# EAGLE design mplex_v2 (EAGLE 7.2.0)

## Sheet 1 of 3
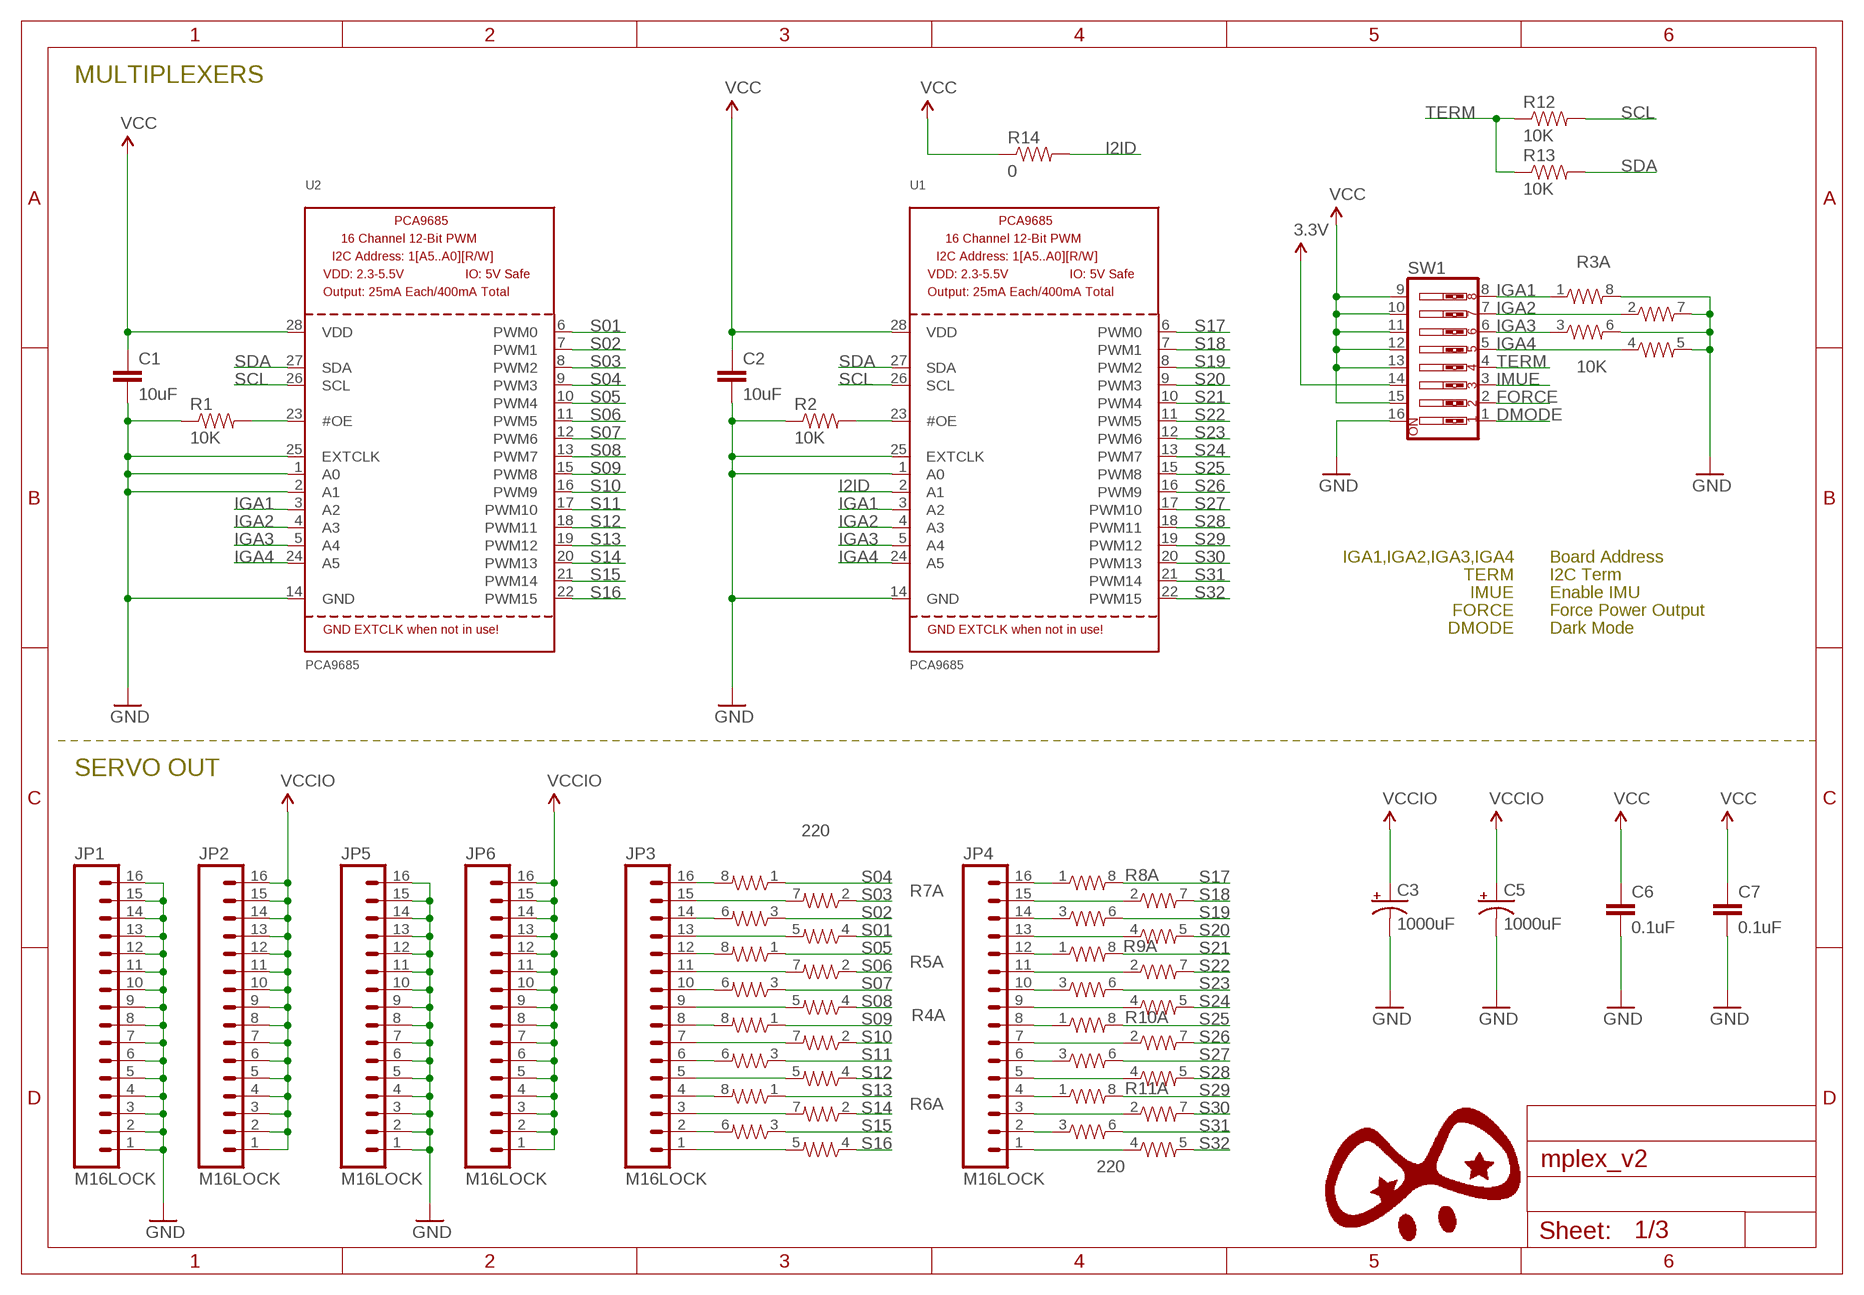
[diagram p0: schematic, sheet 1]

### Parts
C1  10uF  10UF-6.3V-20%(0603)  [0603-CAP]
C2  10uF  10UF-6.3V-20%(0603)  [0603-CAP]
C3  1000uF  CAP_POLD  [PANASONIC_D]
C5  1000uF  CAP_POLD  [PANASONIC_D]
C6  0.1uF  10UF-6.3V-20%(0603)  [0603-CAP]
C7  0.1uF  10UF-6.3V-20%(0603)  [0603-CAP]
JP1  M16LOCK  [1X16_LOCK]
JP2  M16LOCK  [1X16_LOCK]
JP3  M16LOCK  [1X16_LOCK]
JP4  M16LOCK  [1X16_LOCK]
JP5  M16LOCK  [1X16_LOCK]
JP6  M16LOCK  [1X16_LOCK]
R1  10K  RESISTOR0603  [0603-RES]
R2  10K  RESISTOR0603  [0603-RES]
R3  10K  RESISTOR-ARRAY0603-ARV  [0603-ARV]
R4  220  RESISTOR-ARRAY0603-ARV  [0603-ARV]
R5  220  RESISTOR-ARRAY0603-ARV  [0603-ARV]
R6  220  RESISTOR-ARRAY0603-ARV  [0603-ARV]
R7  220  RESISTOR-ARRAY0603-ARV  [0603-ARV]
R8  220  RESISTOR-ARRAY0603-ARV  [0603-ARV]
R9  220  RESISTOR-ARRAY0603-ARV  [0603-ARV]
R10  220  RESISTOR-ARRAY0603-ARV  [0603-ARV]
R11  220  RESISTOR-ARRAY0603-ARV  [0603-ARV]
R12  10K  RESISTOR0603  [0603-RES]
R13  10K  RESISTOR0603  [0603-RES]
R14  0  RESISTOR0603  [0603-RES]
SW1  SW_DIP-8-SMT-HALFSIZE  [DIPSWITCH-08-50MIL]
U1  PCA9685  [TSSOP28]
U2  PCA9685  [TSSOP28]

### Nets
3.3V: SW1.14 ; also sheet 2,3
DMODE: SW1.1 ; also sheet 2
FORCE: SW1.2 ; also sheet 2,3
GND [PlanGND]: C1.2 C2.2 C3.- C5.- C6.2 C7.2 JP1.1 JP1.2 JP1.3 JP1.4 JP1.5 JP1.6 JP1.7 JP1.8 JP1.9 JP1.10 JP1.11 JP1.12 JP1.13 JP1.14 JP1.15 JP1.16 JP5.1 JP5.2 JP5.3 JP5.4 JP5.5 JP5.6 JP5.7 JP5.8 JP5.9 JP5.10 JP5.11 JP5.12 JP5.13 JP5.14 JP5.15 JP5.16 R1.1 R2.1 R3.5 R3.6 R3.7 R3.8 SW1.16 U1.1(A0) U1.14(GND) U1.25(EXTCLK) U2.1(A0) U2.2(A1) U2.14(GND) U2.25(EXTCLK) ; also sheet 2,3
I2ID: R14.2 U1.2(A1)
IGA1: R3.1 SW1.8 U1.3(A2) U2.3(A2) ; also sheet 3
IGA2: R3.2 SW1.7 U1.4(A3) U2.4(A3) ; also sheet 3
IGA3: R3.3 SW1.6 U1.5(A4) U2.5(A4) ; also sheet 3
IGA4: R3.4 SW1.5 U1.24(A5) U2.24(A5) ; also sheet 3
IMUE: SW1.3 ; also sheet 2
N$1: JP3.16 R7.8
N$2: JP3.15 R7.7
N$3: R1.2 U2.23(#OE)
N$4: R2.2 U1.23(#OE)
N$5: JP3.14 R7.6
N$6: JP3.13 R7.5
N$7: JP3.11 R5.7
N$8: JP3.12 R5.8
N$9: JP3.10 R5.6
N$10: JP3.9 R5.5
N$11: JP3.8 R4.8
N$12: JP3.7 R4.7
N$13: JP3.6 R4.6
N$14: JP3.5 R4.5
N$15: JP3.4 R6.8
N$16: JP3.3 R6.7
N$17: JP3.2 R6.6
N$18: JP3.1 R6.5
N$35: JP4.16 R8.1
N$36: JP4.15 R8.2
N$37: JP4.14 R8.3
N$38: JP4.13 R8.4
N$39: JP4.12 R9.1
N$40: JP4.11 R9.2
N$41: JP4.10 R9.3
N$42: JP4.9 R9.4
N$43: JP4.8 R10.1
N$44: JP4.7 R10.2
N$45: JP4.6 R10.3
N$46: JP4.5 R10.4
N$47: JP4.4 R11.1
N$48: JP4.3 R11.2
N$49: JP4.2 R11.3
N$50: JP4.1 R11.4
S01: R7.4 U2.6(PWM0)
S02: R7.3 U2.7(PWM1)
S03: R7.2 U2.8(PWM2)
S04: R7.1 U2.9(PWM3)
S05: R5.1 U2.10(PWM4)
S06: R5.2 U2.11(PWM5)
S07: R5.3 U2.12(PWM6)
S08: R5.4 U2.13(PWM7)
S09: R4.1 U2.15(PWM8)
S10: R4.2 U2.16(PWM9)
S11: R4.3 U2.17(PWM10)
S12: R4.4 U2.18(PWM11)
S13: R6.1 U2.19(PWM12)
S14: R6.2 U2.20(PWM13)
S15: R6.3 U2.21(PWM14)
S16: R6.4 U2.22(PWM15)
S17: R8.8 U1.6(PWM0)
S18: R8.7 U1.7(PWM1)
S19: R8.6 U1.8(PWM2)
S20: R8.5 U1.9(PWM3)
S21: R9.8 U1.10(PWM4)
S22: R9.7 U1.11(PWM5)
S23: R9.6 U1.12(PWM6)
S24: R9.5 U1.13(PWM7)
S25: R10.8 U1.15(PWM8)
S26: R10.7 U1.16(PWM9)
S27: R10.6 U1.17(PWM10)
S28: R10.5 U1.18(PWM11)
S29: R11.8 U1.19(PWM12)
S30: R11.7 U1.20(PWM13)
S31: R11.6 U1.21(PWM14)
S32: R11.5 U1.22(PWM15)
SCL: R12.2 U1.26(SCL) U2.26(SCL) ; also sheet 2,3
SDA: R13.2 U1.27(SDA) U2.27(SDA) ; also sheet 2,3
TERM: R12.1 R13.1 SW1.4
VCC: C1.1 C2.1 C6.1 C7.1 R14.1 SW1.9 SW1.10 SW1.11 SW1.12 SW1.13 SW1.15 U1.28(VDD) U2.28(VDD) ; also sheet 2,3
VCCIO: C3.+ C5.+ JP2.1 JP2.2 JP2.3 JP2.4 JP2.5 JP2.6 JP2.7 JP2.8 JP2.9 JP2.10 JP2.11 JP2.12 JP2.13 JP2.14 JP2.15 JP2.16 JP6.1 JP6.2 JP6.3 JP6.4 JP6.5 JP6.6 JP6.7 JP6.8 JP6.9 JP6.10 JP6.11 JP6.12 JP6.13 JP6.14 JP6.15 JP6.16 ; also sheet 2,3

### Notes on the sheet
- MULTIPLEXERS
- IGA1,IGA2,IGA3,IGA4 | Board Address
- TERM | I2C Term
- IMUE | Enable IMU
- FORCE | Force Power Output
- DMODE | Dark Mode
- SERVO OUT

## Sheet 2 of 3
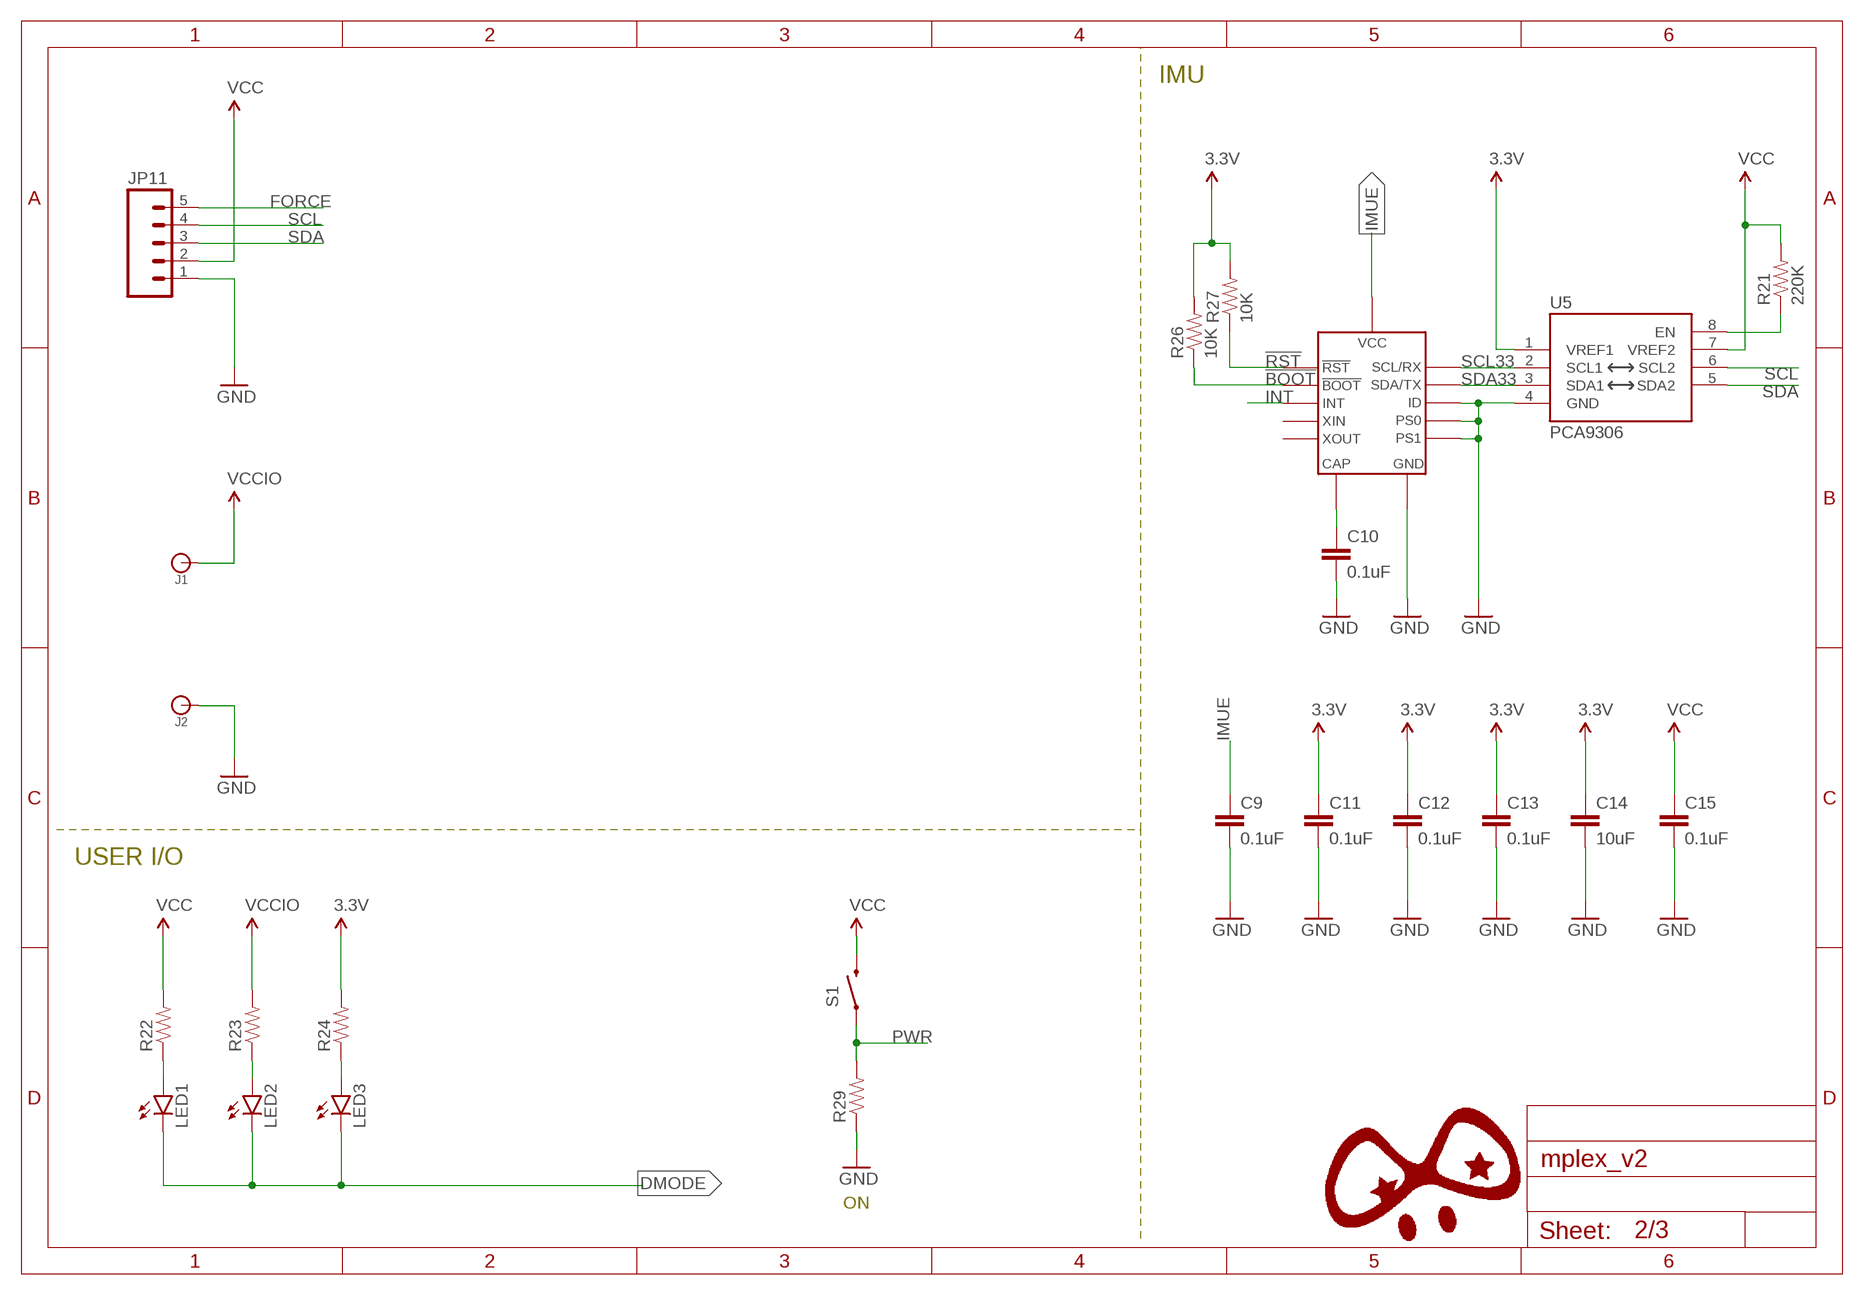
[diagram p1: schematic, sheet 2]

### Parts
C9  0.1uF  10UF-6.3V-20%(0603)  [0603-CAP]
C10  0.1uF  10UF-6.3V-20%(0603)  [0603-CAP]
C11  0.1uF  10UF-6.3V-20%(0603)  [0603-CAP]
C12  0.1uF  10UF-6.3V-20%(0603)  [0603-CAP]
C13  0.1uF  10UF-6.3V-20%(0603)  [0603-CAP]
C14  10uF  10UF-6.3V-20%(0603)  [0603-CAP]
C15  0.1uF  10UF-6.3V-20%(0603)  [0603-CAP]
J1  BANANA_CONN  [BANANA_CONN]
J2  BANANA_CONN  [BANANA_CONN]
JP11  M05LOCK  [1X05_LOCK]
LED1  LED0603  [LED-0603]
LED2  LED0603  [LED-0603]
LED3  LED0603  [LED-0603]
R21  220K  RESISTOR0603-RES  [0603-RES]
R22  RESISTOR0603-RES  [0603-RES]
R23  RESISTOR0603-RES  [0603-RES]
R24  RESISTOR0603-RES  [0603-RES]
R26  10K  RESISTOR0603  [0603-RES]
R27  10K  RESISTOR0603  [0603-RES]
R29  RESISTOR0603-RES  [0603-RES]
S1  SWITCH-MOMENTARY-2SMD  [TACTILE-SWITCH-SMD]
U4  BNO055  [BNO055]
U5  PCA9306  PCA9306PCA9306DC-1:1  [PCA9306DC-1:1]

### Nets
3.3V: C11.1 C12.1 C13.1 C14.1 R24.2 R26.2 R27.2 U5.1(VREF1) ; also sheet 1,3
!BOOT: R26.1 U4.4(BOOT)
!RST: R27.1 U4.1(RST)
DMODE: LED1.C LED2.C LED3.C ; also sheet 1
FORCE: JP11.5 ; also sheet 1,3
GND [PlanGND]: C9.2 C10.2 C11.2 C12.2 C13.2 C14.2 C15.2 J2.P$1 JP11.1 R29.1 U4.2(GND) U4.5(PS1) U4.6(PS0) U4.10(GND) U4.15(GND) U4.16(GND) U4.17(ID) U4.18(GND) U4.25(GND) U5.4(GND) ; also sheet 1,3
IMUE: C9.1 U4.3(VCC) U4.28(VCC) ; also sheet 1
INT: U4.14(INT)
N$19: LED1.A R22.1
N$20: R21.1 U5.8(EN)
N$22: LED2.A R23.1
N$24: C10.1 U4.9(CAP)
N$25: LED3.A R24.1
PWR: R29.2 S1.1
SCL: JP11.4 U5.6(SCL2) ; also sheet 1,3
SCL33: U4.19(SCL/RX) U5.2(SCL1)
SDA: JP11.3 U5.5(SDA2) ; also sheet 1,3
SDA33: U4.20(SDA/TX) U5.3(SDA1)
VCC: C15.1 JP11.2 R21.2 R22.2 S1.3 U5.7(VREF2) ; also sheet 1,3
VCCIO: J1.P$1 R23.2 ; also sheet 1,3
Unconnected: U4.26(XOUT) U4.27(XIN)

### Notes on the sheet
- IMU
- USER I/O
- ON

## Sheet 3 of 3
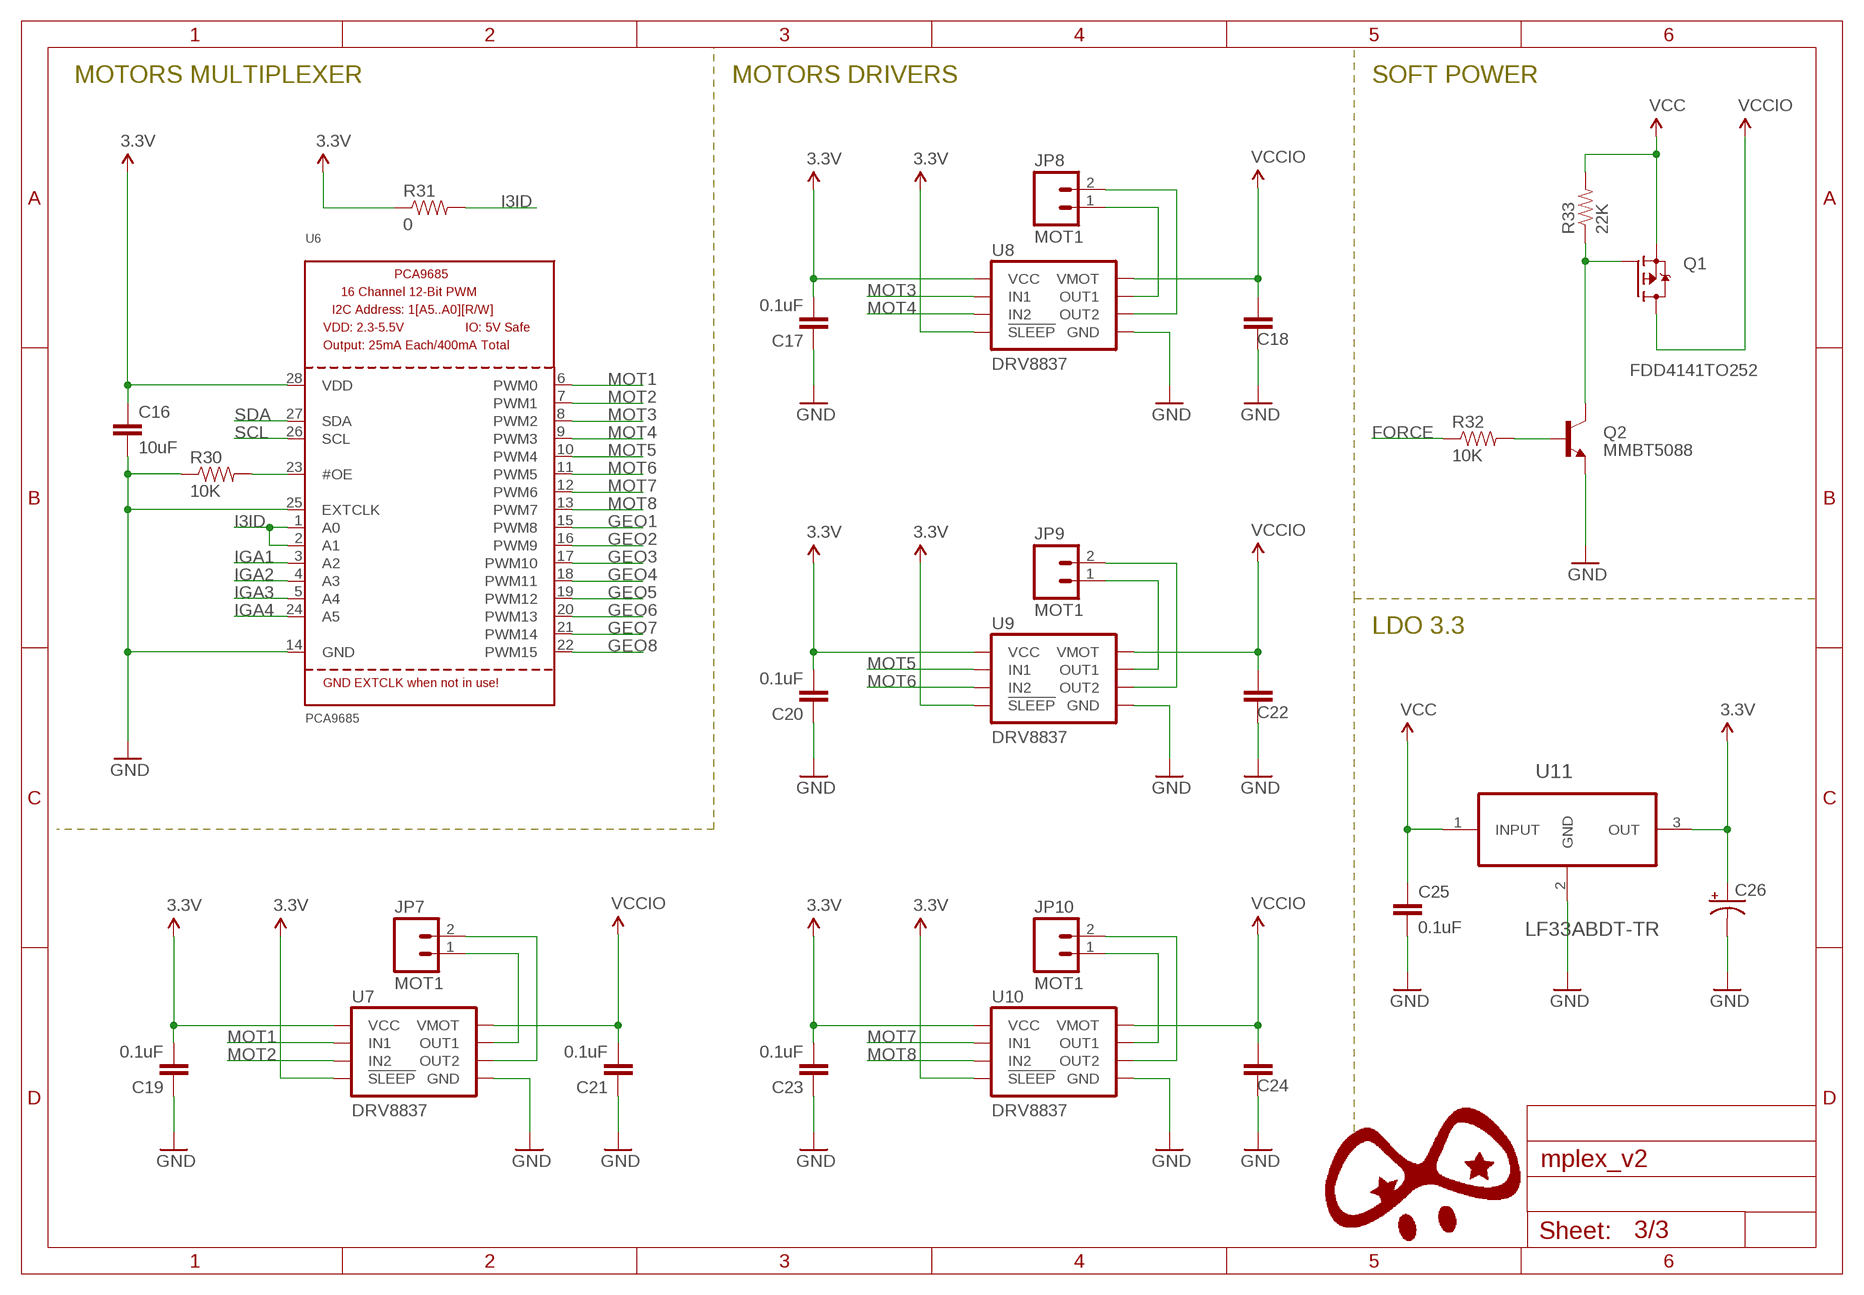
[diagram p2: schematic, sheet 3]

### Parts
C16  10uF  10UF-6.3V-20%(0603)  [0603-CAP]
C17  0.1uF  CAP0603-CAP  [0603-CAP]
C18  0.1uF  CAP0603-CAP  [0603-CAP]
C19  0.1uF  CAP0603-CAP  [0603-CAP]
C20  0.1uF  CAP0603-CAP  [0603-CAP]
C21  0.1uF  CAP0603-CAP  [0603-CAP]
C22  0.1uF  CAP0603-CAP  [0603-CAP]
C23  0.1uF  CAP0603-CAP  [0603-CAP]
C24  0.1uF  CAP0603-CAP  [0603-CAP]
C25  0.1uF  CAP1210  [1210]
C26  CAP_POLD  [PANASONIC_D]
JP7  MOT1  M02POLAR  [MOLEX-1X2]
JP8  MOT1  M02POLAR  [MOLEX-1X2]
JP9  MOT1  M02POLAR  [MOLEX-1X2]
JP10  MOT1  M02POLAR  [MOLEX-1X2]
Q1  FDD4141TO252  [TO252]
Q2  MMBT5088  TRANSISTOR_NPNMMBT5088  [SOT23-3]
R30  10K  RESISTOR0603  [0603-RES]
R31  0  RESISTOR0603  [0603-RES]
R32  10K  RESISTOR0603  [0603-RES]
R33  22K  RESISTOR0603  [0603-RES]
U6  PCA9685  [TSSOP28]
U7  DRV8837  [DSG]
U8  DRV8837  [DSG]
U9  DRV8837  [DSG]
U10  DRV8837  [DSG]
U11  LF33ABDT-TR  [TO228P972X240-3N]

### Nets
3.3V: C16.1 C17.2 C19.2 C20.2 C23.2 C26.+ R31.1 U6.28(VDD) U7.7(!SLEEP) U7.8(VCC) U8.7(!SLEEP) U8.8(VCC) U9.7(!SLEEP) U9.8(VCC) U10.7(!SLEEP) U10.8(VCC) U11.3(OUT) ; also sheet 1,2
FORCE: R32.1 ; also sheet 1,2
GEO1: U6.15(PWM8)
GEO2: U6.16(PWM9)
GEO3: U6.17(PWM10)
GEO4: U6.18(PWM11)
GEO5: U6.19(PWM12)
GEO6: U6.20(PWM13)
GEO7: U6.21(PWM14)
GEO8: U6.22(PWM15)
GND [PlanGND]: C16.2 C17.1 C18.1 C19.1 C20.1 C21.1 C22.1 C23.1 C24.1 C25.2 C26.- Q2.2(E) R30.1 U6.14(GND) U6.25(EXTCLK) U7.4(GND) U7.PAD(GND) U8.4(GND) U8.PAD(GND) U9.4(GND) U9.PAD(GND) U10.4(GND) U10.PAD(GND) U11.2(GND) ; also sheet 1,2
I3ID: R31.2 U6.1(A0) U6.2(A1)
IGA1: U6.3(A2) ; also sheet 1
IGA2: U6.4(A3) ; also sheet 1
IGA3: U6.5(A4) ; also sheet 1
IGA4: U6.24(A5) ; also sheet 1
MOT1: U6.6(PWM0) U7.6(IN1)
MOT2: U6.7(PWM1) U7.5(IN2)
MOT3: U6.8(PWM2) U8.6(IN1)
MOT4: U6.9(PWM3) U8.5(IN2)
MOT5: U6.10(PWM4) U9.6(IN1)
MOT6: U6.11(PWM5) U9.5(IN2)
MOT7: U6.12(PWM6) U10.6(IN1)
MOT8: U6.13(PWM7) U10.5(IN2)
N$23: R30.2 U6.23(#OE)
N$26: JP7.1 U7.2(OUT1)
N$28: JP7.2 U7.3(OUT2)
N$29: JP8.1 U8.2(OUT1)
N$30: JP8.2 U8.3(OUT2)
N$31: JP9.1 U9.2(OUT1)
N$32: JP9.2 U9.3(OUT2)
N$33: JP10.1 U10.2(OUT1)
N$34: Q2.1(B) R32.2
N$52: Q1.1(G) Q2.3(C) R33.1
N$66: JP10.2 U10.3(OUT2)
SCL: U6.26(SCL) ; also sheet 1,2
SDA: U6.27(SDA) ; also sheet 1,2
VCC: C25.1 Q1.2(S) R33.2 U11.1(INPUT) ; also sheet 1,2
VCCIO: C18.2 C21.2 C22.2 C24.2 Q1.3(D) U7.1(VMOT) U8.1(VMOT) U9.1(VMOT) U10.1(VMOT) ; also sheet 1,2

### Notes on the sheet
- MOTORS MULTIPLEXER | MOTORS DRIVERS | SOFT POWER
- LDO 3.3

## Library data of the parts
C1 C2 C14 C16 = SparkFun-Capacitors:10UF-6.3V-20%(0603): CAP-11015; PROD_ID: CAP-11015
C3 C5 C26 = SparkFun-Capacitors:CAP_POL: Capacitor Polarized These are standard SMD and PTH capacitors. Normally 10uF, 47uF, and 100uF in electrolytic and tantalum varieties. Always verify the external diameter of the through hole cap, it varies with capacity, voltage, and manufacturer. The EIA devices should be standard.
C6 C7 C9-C13 C15 = SparkFun-Capacitors:10UF-6.3V-20%(0603): CAP-11015; PROD_ID: CAP-11015; VALUE: 10uF
C17-C24 = SparkFun-Passives:CAP: Capacitor Standard 0603 ceramic capacitor, and 0.1" leaded capacitor.
C25 = SparkFun-Capacitors:CAP: Capacitor Standard 0603 ceramic capacitor, and 0.1" leaded capacitor.
J1 J2 = SparkFun-Connectors:BANANA_CONN: Through-hole banana jack
JP1-JP6 = SparkFun-Connectors:M16: 1x16 .1" header
JP7-JP10 = SparkFun-Connectors:M02: Standard 2-pin 0.1" header. Use with - straight break away headers ( PRT-00116) - right angle break away headers (PRT-00553) - swiss pins (PRT-00743) - machine pins (PRT-00117) - female headers (PRT-00115) Molex polarized connector foot print use with: PRT-08233 with associated crimp pins and housings. 2.54_SCREWTERM for use with PRT-10571. 3.5mm Screw Terminal footprints for PRT-08084 5mm Screw Terminal footprints for use with PRT-08432
JP11 = SparkFun-Connectors:M05: Header 5 Standard 5-pin 0.1" header. Use with straight break away headers (SKU : PRT-00116), right angle break away headers (PRT-00553), swiss pins (PRT-00743), machine pins (PRT-00117), and female headers (PRT-00115). Molex polarized connector foot print use with SKU : PRT-08230 with associated crimp pins and housings.
LED1-LED3 = SparkFun-LED:LED: LEDs Standard schematic elements and footprints for 5mm, 3mm, 1206, and 0603 sized LEDs. 5mm - Spark Fun Electronics SKU : COM-00529 (and others)
Q1 = transistor-fet:FDD4141: P-Channel PowerTrench® MOSFET Source: FDD4141.pdf
Q2 = SparkFun-DiscreteSemi:TRANSISTOR_NPN: Generic NPN BJT MMBT2222A - TRANS-08049 (SOT-23, 1A 40V) MPSA42 - TRANS-09116 (SOT-23, 500mA 300V) MMBT5088LT1G - TRANS-11160 (SOT-23, 50 mA 30V) BC547 - COM-08928 <http://www.sparkfun.com/products/8928> (TO-92 45V 100mA) (1.Collector 2.Base 3.Emitter) 2N3904 - COM-00521 <http://www.sparkfun.com/products/521> (TO-92 40V 200mA) (1.Emitter 2.Base 3.Collector) P2N2222A - COM-12852 <http://www.sparkfun.com/products/12852> (TO-92 40V 600mA) (1.Collector 2.Base 3.Emitter); PROD_ID: TRANS-11160
R1 R2 R12-R14 R21-R24 R26 R27 R29-R33 = SparkFun-Resistors:RESISTOR: Resistor Basic schematic elements and footprints for 0603, 1206, and PTH resistors.
R3-R11 = SparkFun-Resistors:RESISTOR-ARRAY: Array Chip Resistor Source: RS Component / Phycomp
S1 = SparkFun-Electromechanical:SWITCH-MOMENTARY-2: Various NO switches- pushbuttons, reed, etc; PROD_ID: SWCH-08247
SW1 = SparkFun-Electromechanical:SW_DIP-8: DIP Switch 8 Position
U1 U2 U6 = microbuilder:PCA9685: PCA9685 - 16 Channel 12-Bit I2C PWM Controller 5.0V tolerant 16 channel, 12-bit I2C PWM controller with 25mA per output (max. 400mA total) Digikey: 568-5931-1-ND
U4 = alvaroferran:BNO055: The BNO055 is a System in Package (SiP), integrating a triaxial 14-bit accelerometer, a triaxial 16-bit gyroscope with a range of ±2000 degrees per second, a triaxial geomagnetic sensor and a 32-bit microcontroller running the company’s BSX3.0 FusionLib software. At just 5.2 x 3.8 x 1.1 mm3, it is significantly smaller than comparable discrete or system-on-board solutions.
U5 = SparkFun-DigitalIC:PCA9306: Bidirectional I2C level shifter. NOT compatible with all available part number pinout schemes- DOUBLE CHECK!!!; PROD_ID: IC-10023
U7-U10 = packages(ti):DRV8837
U11 = STM-LF33ABDT-TR:LF33ABDT-TR: LDO, 0.45VDO, 1A, 3.3V, 1%, 3TO252; MPN: LF33ABDT-TR; OC_FARNELL: 2253503; OC_NEWARK: 26M0226; PACKAGE: DPAK; SUPPLIER: STMicroelectronics

## Board
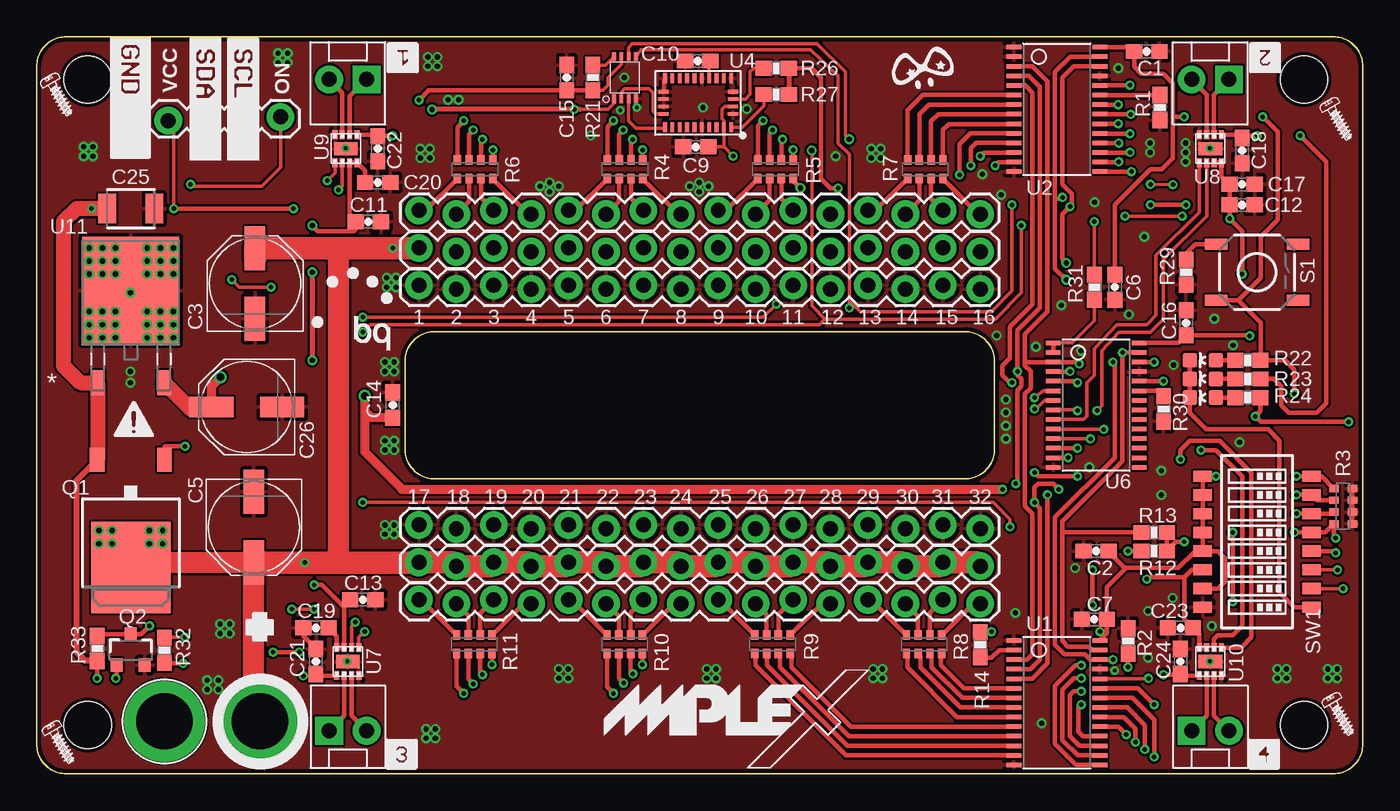
[diagram p3: board, top side]
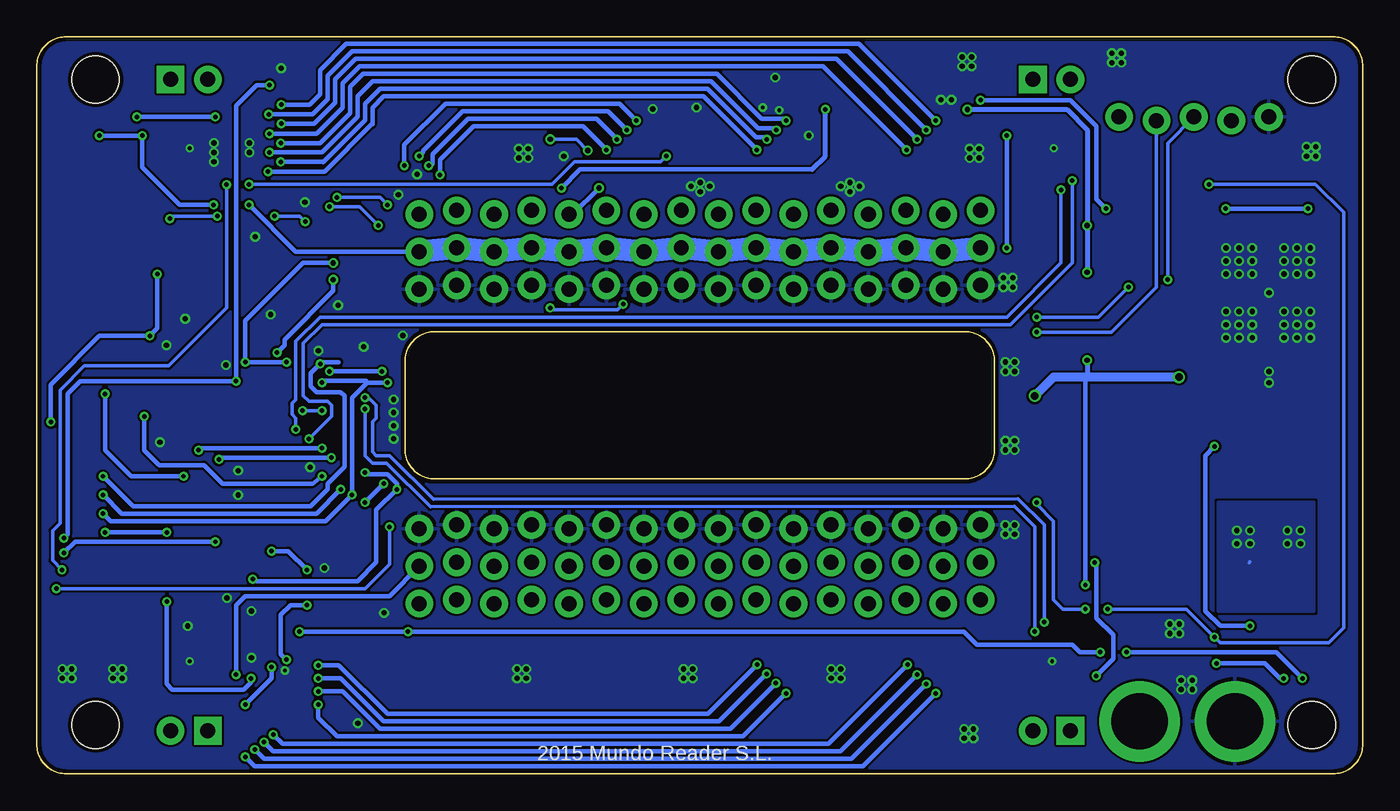
[diagram p4: board, bottom side, seen from below]

Size 90 x 50 mm. Coordinates in mm from the lower left corner, seen from the top.
Outline: 90,1.86 89.99,1.73 89.96,1.6 89.93,1.47 89.89,1.34 89.79,1.1 89.73,0.99 89.66,0.88 89.59,0.78 89.5,0.68 89.32,0.5 89.22,0.42 89.12,0.34 89.01,0.27 88.9,0.21 88.66,0.11 88.53,0.07 88.4,0.04 88.27,0.01 88.14,0 1.86,0 1.73,0.01 1.6,0.04 1.47,0.07 1.34,0.11 1.1,0.21 0.99,0.27 0.88,0.34 0.78,0.42 0.68,0.5 0.5,0.68 0.42,0.78 0.34,0.88 0.27,0.99 0.21,1.1 0.11,1.34 0.07,1.47 0.04,1.6 0.01,1.73 0,1.86 0,48.14 0.01,48.27 0.04,48.4 0.07,48.53 0.11,48.66 0.16,48.78 0.21,48.9 0.27,49.01 0.34,49.12 0.42,49.22 0.5,49.32 0.68,49.5 0.78,49.59 0.88,49.66 0.99,49.73 1.1,49.79 1.34,49.89 1.47,49.93 1.6,49.96 1.73,49.99 1.86,50 88.14,50 88.27,49.99 88.4,49.96 88.53,49.93 88.66,49.89 88.9,49.79 89.01,49.73 89.12,49.66 89.22,49.59 89.32,49.5 89.5,49.32 89.59,49.22 89.73,49.01 89.79,48.9 89.84,48.78 89.89,48.66 89.93,48.53 89.96,48.4 89.99,48.27 90,48.14 90,1.86
Outline: 65,21.86 64.99,21.73 64.96,21.6 64.93,21.47 64.89,21.34 64.79,21.1 64.73,20.99 64.66,20.88 64.59,20.78 64.5,20.68 64.32,20.5 64.22,20.42 64.12,20.34 64.01,20.27 63.9,20.21 63.66,20.11 63.53,20.07 63.4,20.04 63.27,20.01 63.14,20 26.86,20 26.73,20.01 26.6,20.04 26.47,20.07 26.34,20.11 26.1,20.21 25.99,20.27 25.88,20.34 25.78,20.42 25.68,20.5 25.5,20.68 25.42,20.78 25.34,20.88 25.27,20.99 25.21,21.1 25.11,21.34 25.07,21.47 25.04,21.6 25.01,21.73 25,21.86 25,28.14 25.01,28.27 25.04,28.4 25.07,28.53 25.11,28.66 25.21,28.9 25.27,29.01 25.34,29.12 25.42,29.22 25.5,29.32 25.68,29.5 25.78,29.59 25.88,29.66 25.99,29.73 26.1,29.79 26.34,29.89 26.47,29.93 26.6,29.96 26.73,29.99 26.86,30 63.14,30 63.27,29.99 63.4,29.96 63.53,29.93 63.66,29.89 63.9,29.79 64.01,29.73 64.12,29.66 64.22,29.59 64.32,29.5 64.5,29.32 64.59,29.22 64.66,29.12 64.73,29.01 64.79,28.9 64.89,28.66 64.93,28.53 64.96,28.4 64.99,28.27 65,28.14 65,21.86
Copper layers (1*16): Top 0.035mm / dielectric 1.5mm / Bottom 0.035mm
Design rules "pighixxx_CAM_DRC_V1.5": minimum track width 6mil, minimum drill 10mil, track to track 6mil, track to pad 6mil, pad to pad 6mil, via to via 6mil, smd to smd 0mil, copper to edge 10mil, drill to drill 10mil, minimum pad ring 10mil, minimum via ring 6mil, stop-mask expansion 2mil, vias tented up to drill 100mil, thermal gap 10mil
Holes 3.2 mm at 3.46,47.11 86.01,47.11 86.01,3.29 3.46,3.29

### Footprints (pad centres in the part's own frame; a part is rotated, then mirrored left to right if it is on the bottom)
0603-CAP = smd 1.1 x 1: 1 -0.85,0; 2 0.85,0
PANASONIC_D = smd 3 x 1.4: + 2.4,0; - -2.4,0
1210 = smd 1.2 x 2: 1 -1.6,0; 2 1.6,0
BANANA_CONN = drill 3.81 pad 5.461: P$1 0,0
1X16_LOCK = drill 1.016 pad 1.88: 1 0,0.127; 2 2.54,-0.127; 3 5.08,0.127; 4 7.62,-0.127; 5 10.16,0.127; 6 12.7,-0.127; 7 15.24,0.127; 8 17.78,-0.127; 9 20.32,0.127; 10 22.86,-0.127; 11 25.4,0.127; 12 27.94,-0.127; 13 30.48,0.127; 14 33.02,-0.127; 15 35.56,0.127; 16 38.1,-0.127
MOLEX-1X2 = drill 1.016 pad 1.88 square: 1 0,0 | drill 1.016 pad 1.88: 2 2.54,0
1X05_LOCK = drill 1.016 pad 1.88: 1 0,0.127; 2 2.54,-0.127; 3 5.08,0.127; 4 7.62,-0.127; 5 10.16,0.127
LED-0603 = smd 1 x 1: A 0,-0.877; C 0,0.877
TO252 = smd 1 x 1.6: 1 -2.28,-4.8; 2 2.28,-4.8 | smd 5.4 x 6.2: 3 0,2.5
SOT23-3 = smd 0.8 x 0.9: 1 -0.95,-1; 2 0.95,-1; 3 0,1.1
0603-RES = smd 1.1 x 1: 1 -0.85,0; 2 0.85,0
0603-ARV = smd 0.5 x 0.65: 1 -1.2,-0.625; 2 -0.4,-0.625; 3 0.4,-0.625; 4 1.2,-0.625; 5 1.2,0.625; 6 0.4,0.625; 7 -0.4,0.625; 8 -1.2,0.625
TACTILE-SWITCH-SMD = smd 1.524 x 0.762: 1 -2.794,1.905; 2 2.794,1.905; 3 -2.794,-1.905; 4 2.794,-1.905
DIPSWITCH-08-50MIL = smd 0.762 x 1.27: 1 -4.445,-3.7; 2 -3.175,-3.7; 3 -1.905,-3.7; 4 -0.635,-3.7; 5 0.635,-3.7; 6 1.905,-3.7; 7 3.175,-3.7; 8 4.445,-3.7; 9 4.445,3.7; 10 3.175,3.7; 11 1.905,3.7; 12 0.635,3.7; 13 -0.635,3.7; 14 -1.905,3.7; 15 -3.175,3.7; 16 -4.445,3.7
TSSOP28 = smd 0.305 x 0.991: 1 -4.225,-2.918; 2 -3.575,-2.918; 3 -2.925,-2.918; 4 -2.275,-2.918; 5 -1.625,-2.918; 6 -0.975,-2.918; 7 -0.325,-2.918; 8 0.325,-2.918; 9 0.975,-2.918; 10 1.625,-2.918; 11 2.275,-2.918; 12 2.925,-2.918; 13 3.575,-2.918; 14 4.225,-2.918; 15 4.225,2.918; 16 3.575,2.918; 17 2.925,2.918; 18 2.275,2.918; 19 1.625,2.918; 20 0.975,2.918; 21 0.325,2.918; 22 -0.325,2.918; 23 -0.975,2.918; 24 -1.625,2.918; 25 -2.275,2.918; 26 -2.925,2.918; 27 -3.575,2.918; 28 -4.225,2.918
BNO055 = smd 0.25 x 0.68: 1 -2.279,1.72; 6 -2.279,-1.606; 7 -1.779,-1.606; 8 -1.279,-1.606; 9 -0.779,-1.606; 10 -0.279,-1.606; 11 0.221,-1.606; 12 0.721,-1.606; 13 1.221,-1.606; 14 1.721,-1.606; 15 2.221,-1.606; 20 2.221,1.72; 21 1.721,1.72; 22 1.221,1.72; 23 0.721,1.72; 24 0.221,1.72; 25 -0.279,1.72; 26 -0.779,1.72; 27 -1.279,1.72; 28 -1.779,1.72 | smd 0.68 x 0.25: 2 -2.387,0.809; 3 -2.387,0.309; 4 -2.387,-0.191; 5 -2.387,-0.691; 16 2.332,-0.692; 17 2.332,-0.192; 18 2.332,0.308; 19 2.332,0.808
PCA9306DC-1:1 = smd 0.25 x 0.602: 1 -0.73,-1.446; 2 -0.23,-1.446; 3 0.27,-1.446; 4 0.77,-1.446; 5 0.77,1.431; 6 0.27,1.431; 7 -0.23,1.431; 8 -0.73,1.431
DSG = smd 0.6 x 0.35: 1 -0.95,0.75; 2 -0.95,0.25; 3 -0.95,-0.25; 4 -0.95,-0.75; 5 0.95,-0.75; 6 0.95,-0.25; 7 0.95,0.25; 8 0.95,0.75 | smd 0.9 x 1.6: PAD 0,0
TO228P972X240-3N = smd 0.94 x 1.702: 1 -2.261,-6.096; 3 2.261,-6.096 | smd 6.604 x 7.315: 2 0,0.152

### Placement (x,y rotation side)
C1  75.34,49.01 0 top
C2  71.91,15.1 180 top
C3  14.81,33.26 90 top
C5  14.73,16.73 270 top
C6  73.18,33.01 270 top
C7  71.78,10.48 180 top
C9  44.73,42.54 180 top
C10  44.86,48.35 180 top
C11  22.51,37.46 0 top
C12  81.82,38.6 0 top
C13  22.13,11.8 0 top
C14  24.16,25.01 90 top
C15  35.97,47.23 90 top
C16  78.01,30.6 90 top
C17  81.82,40 180 top
C18  81.82,42.28 90 top
C19  18.95,9.9 0 top
C20  23.14,40.12 180 top
C21  18.95,7.61 270 top
C22  23.14,42.41 90 top
C23  77.63,9.9 0 top
C24  77.63,7.61 270 top
C25  6.38,38.34 0 top
C26  14.25,24.88 180 top
J1  15.14,3.55 0 top
J2  8.66,3.55 0 top
JP1  25.94,16.75 0 top
JP2  25.94,14.21 0 top
JP3  25.94,38.09 0 top
JP4  25.94,11.67 0 top
JP5  25.94,33.01 0 top
JP6  25.94,35.55 0 top
JP7  19.84,2.91 0 top
JP8  80.93,47.11 180 top
JP9  22.38,47.11 180 top
JP10  78.39,2.91 0 top
JP11  6.38,44.44 0 top
LED1  79.15,28.06 90 top
LED2  79.15,26.79 90 top
LED3  79.15,25.52 90 top
Q1  6.38,16.5 180 top
Q2  6.38,8.37 0 top
R1  76.23,45.2 90 top
R2  74.07,9.01 270 top
R3  88.67,18.15 270 top
R4  39.93,41.01 180 top
R5  50.14,41.01 180 top
R6  29.75,41.01 180 top
R7  60.3,41.01 180 top
R8  60.23,8.78 180 top
R9  49.94,8.78 180 top
R10  39.91,8.78 180 top
R11  29.7,8.78 180 top
R12  75.85,15.1 180 top
R13  75.85,16.37 180 top
R14  64.04,8.75 270 top
R21  37.75,47.23 270 top
R22  82.2,28.06 0 top
R23  82.2,26.79 0 top
R24  82.2,25.52 0 top
R26  50.19,47.87 0 top
R27  50.19,46.09 0 top
R29  78.01,34.03 90 top
R30  76.48,24.76 90 top
R31  71.78,33.01 270 top
R32  8.66,8.37 270 top
R33  4.09,8.5 270 top
S1  82.83,34.03 0 top
SW1  82.83,15.74 90 top
U1  69.24,4.82 270 top
U2  69.24,45.08 270 top
U4  44.86,45.58 180 top
U5  39.91,47.23 0 top
U6  71.91,25.01 270 top
U7  21.11,7.61 90 top
U8  79.66,42.41 270 top
U9  20.98,42.41 270 top
U10  79.66,7.61 90 top
U11  6.38,32.63 0 top
U$1  [SCREW]  1.04,1.51 0 top
U$2  [MPLEX_LOGO]  38.51,0.37 0 top
U$3  [SCREW]  87.79,43.81 0 top
U$4  [SCREW]  87.91,3.42 0 top
U$5  [S_1]  25.81,49.52 180 top
U$6  [SCREW]  0.92,45.46 0 top
U$7  [S_ATTENTION]  5.11,22.72 0 top
U$8  [PIGHIXXX_LOGO]  58.07,46.47 0 top
U$9  [BQ_LOGO_SMALL]  18.67,28.74 0 top
U$10  [S_2]  84.36,49.52 180 top
U$11  [S_3]  23.78,0.37 0 top
U$12  [S_4]  82.32,0.37 0 top
U$13  [S_SCL]  14.99,49.9 180 top
U$14  [S_SDA]  12.42,49.88 180 top
U$15  [S_KICIK_GND_2]  8.23,50 180 top

### Tracks (layer width: path | path; a pad name or v marks a point on that pad's centre or on a via)
3.3V  (via drill 0.3, 0.36, 0.51)
  Top 0.254: U5.1 39.18,45.49 38.76,45.08 36.86,45.08 | R31.1 v71.78,37.46 | v73.87,37.84 v77.75,37.84
  Top 0.305: U9.7 21.23,37.97 21.66,37.54 C11.1 | U9.8 22.29,40.9 C20.2 | U7.8 20.36,9.34 C19.2 | U7.7 20.86,11.29 | U8.8 80.41,40.55 C17.2 C12.1 v80.97,37.67 81.82,36.82 v81.82,33.9 | U10.8 78.91,9.46 C23.2 77.88,10.49 77.88,13.33 | 20.86,11.29 19.33,12.82 v18.82,12.82 | C11.1 21.49,37.46 | C13.1 21.28,11.71 20.86,11.29 | SW1.14 78.39,13.83 77.88,13.33 | 77.88,13.33 75.59,13.33 v75.34,13.2 | R24.2 83.05,24.59 v82.71,24.25 83.09,23.87 v89.06,23.87 | v67.72,20.44 67.97,20.18 v70.64,20.18 | U6.28 77.49,29.23 C16.1 82.29,29.75 v82.32,29.71 | R26.2 52.61,47.87 53.24,47.23 53.24,40.38 53.88,39.74 v54.38,39.74 | v18.7,37.2 19.08,36.82 21.49,36.82 21.66,36.99 C11.1
  Top 0.356: U8.8 U8.7 | U9.8 U9.7 | U7.8 U7.7 | U10.8 U10.7 | R26.2 R27.2 | 36.86,45.08 v36.48,45.08 v26.83,45.08 | v18.7,34.03 v18.7,28.06
  Top 0.61: C26.+ 11.85,26.29 v12.47,26.91 | v22.25,25.64 22.25,24.63 | 22.25,24.63 22.25,21.83 24.79,19.29 v65.56,19.29 | C14.1 22.72,24.16 22.25,24.63
  Top 1.016: U11.3 10.42,24.76 C26.+
  Bottom 0.254: v77.75,37.84 80.8,37.84 v80.97,37.67 | v71.78,37.46 72.16,37.84 v73.87,37.84
  Bottom 0.305: v18.7,37.2 18.82,37.07 | 18.82,26.91 v18.82,12.82 | v75.34,13.2 75.09,13.07 68.23,13.07 66.96,14.34 66.96,17.9 v65.56,19.29 65.56,19.68 66.2,20.31 67.59,20.31 v67.72,20.44 | v82.71,24.25 82.71,21.96 81.69,20.95 78.64,20.95 77.37,19.68 71.28,19.68 v70.64,20.18 | v54.38,39.74 53.11,41.01 37.37,41.01 | v81.82,33.9 81.82,30.22 v82.32,29.71 85.75,29.71 89.06,26.41 v89.06,23.87
  Bottom 0.356: v26.83,45.08 20.09,45.08 18.7,43.68 v18.7,37.2 | 37.37,41.01 36.48,41.9 v36.48,45.08 | 18.82,37.07 18.7,36.95 v18.7,34.03 | v18.7,28.06 18.7,26.91 19.08,26.91
  Bottom 0.61: v12.47,26.91 18.82,26.91 19.08,26.91 20.98,26.91 v22.25,25.64
!BOOT
  Top 0.254: U4.4 48.1,45.77 48.42,46.09 48.42,47.62 48.67,47.87 R26.1
!RST
  Top 0.254: U4.1 47.89,43.86 49.36,45.33 R27.1
DMODE
  Top 0.305: LED1.C LED2.C LED3.C 78.26,25.51 78.26,24.5 79.4,23.36 83.59,23.36 84.36,22.6 84.36,12.31 85.37,11.29 SW1.1
FORCE  (via drill 0.3)
  Top 0.254: v22.13,18.41 64.93,18.41 66.07,17.26 v66.07,16.75 | v88.67,12.56 SW1.2 | v10.06,9.26 8.7,9.26 R32.1 | v18.82,11.17 v17.3,11.17 | JP11.5 16.54,41.14 15.27,39.87 10.57,39.87 v10.44,40
  Bottom 0.254: v88.67,12.56 67.72,12.56 66.07,14.21 v66.07,16.75 | v22.13,18.41 22.13,18.28 20.98,17.14 20.98,11.8 20.35,11.17 v18.82,11.17 | v17.3,11.17 11.97,11.17 v10.06,9.26 9.68,8.88 2.31,8.88 1.3,9.9 1.3,38.09 3.2,40 v10.44,40
GND  (via drill 0.25, 0.36)
  Top 0.254: U4.15 42.53,47.08 U4.16
  Top 0.305: R3.8 R3.7 R3.6 R3.5 | C21.1 18.1,9.31 C19.1
  other vias: 45.21,45.2 39.88,47.23 56.64,42.41 73.41,47.87 44.96,40.12 23.62,22.6 27.92,45.74 28.63,45.74 23.62,27.3 23.62,21.96 24.26,22.6 24.26,21.96 24.26,27.3 24.26,27.93 23.62,27.93 24.39,33.01 23.75,33.01 23.75,33.65 24.39,33.65 24.26,16.88 24.26,16.25 23.62,16.25 23.62,16.88 34.8,40.12 27.18,48 26.67,42.41 16.39,48.25 3.81,42.54 27.05,2.4 35.44,7.1 45.47,7.1 56.77,7.1 48.19,45.1 37.59,43.3 40.72,45.2 39.6,45.02 36.07,7.1 36.07,6.47 35.44,6.47 46.1,7.1 46.1,6.47 45.47,6.47 57.41,7.1 57.41,6.47 56.77,6.47 26.42,2.4 26.42,3.04 27.05,3.04 17.02,48.25 17.02,48.89 16.39,48.89 26.55,48 26.55,48.63 27.18,48.63 44.96,39.49 44.33,39.87 45.6,39.87 34.8,39.49 35.44,39.87 34.17,39.87 57.28,42.41 57.28,41.77 56.64,41.77 26.04,42.41 26.67,41.77 26.04,41.77 3.81,41.9 3.18,42.54 3.18,41.9 12.32,6.34 12.32,5.71 11.56,5.71 11.56,6.34 3.56,35.68 4.45,35.68 5.34,35.68 9.27,35.68 8.38,35.68 7.5,35.68 3.56,34.79 4.45,34.79 5.34,34.79 7.5,34.79 8.38,34.79 9.27,34.79 3.56,33.9 4.45,33.9 5.34,33.9 7.5,33.9 8.38,33.9 9.27,33.9 3.56,29.58 3.56,30.47 3.56,31.36 4.45,31.36 4.45,30.47 4.45,29.58 5.34,31.36 5.34,30.47 5.34,29.58 9.27,31.36 8.38,31.36 7.5,31.36 7.5,30.47 8.38,30.47 9.27,30.47 9.27,29.58 8.38,29.58 7.5,29.58 6.35,32.63 6.35,26.53 6.35,27.3 64.19,40.68 71.81,38.78 65.46,39.28 54.23,41.9 84.2,7.1 84.84,7.1 84.84,6.47 84.2,6.47 87.63,7.1 88.27,7.1 88.27,6.47 87.63,6.47 66.42,10.91 70.49,13.96 81.64,22.49 76.33,20.56 76.33,18.91 68.2,3.42 75.44,7.86 75.44,11.04 77.09,11.93 79.76,10.02 71.45,20.79 75.57,42.15 77.98,42.15 77.98,42.79 77.98,41.52 75.57,42.79 73.15,7 79.63,7.64 79.63,42.43 20.96,42.43 21.08,7.64 75.19,36.44 74.12,31.16 77.17,27.73 81.21,29.07 79.94,30.88 70.89,28.69 69.55,31.79 67.82,28.97 65.15,29.73 65.79,22.72 65.79,23.61 65.79,24.5 65.79,25.39 13.08,10.15 13.08,9.52 12.45,9.52 12.45,10.15
  pour Top (rank 2): -0.35,50.28 -0.35,-0.52 90.45,-0.52 90.45,50.28
  pour Bottom (rank 2): -0.35,50.28 -0.35,-0.52 90.45,-0.52 90.45,50.28
I2ID
  Top 0.305: U1.2 65.33,8.39 64.8,7.86 64.08,7.86 R14.2
I3ID
  Top 0.254: U6.1 70.29,29.23 71.78,30.72 R31.2
  Top 0.305: U6.2 U6.1
IGA1  (via drill 0.3)
  Top 0.305: U2.3 67.59,48 68.61,46.98 68.61,31.36 67.08,29.84 67.08,28.06 | 67.08,28.06 67.08,27.68 67.47,27.3 67.47,26.15 67.08,25.77 67.08,18.15 67.59,17.64 67.59,8.12 67.22,7.74 U1.3 | 67.08,28.06 67.21,27.93 U6.3 70.76,27.93 v70.77,27.8 | R3.1 87.22,20.18 SW1.8 v85.5,20.18
  Bottom 0.305: v85.5,20.18 83.47,18.15 71.4,18.15 70.26,19.29 70.26,19.68 69.12,20.82 69.12,25.65 69.37,25.9 71.02,25.9 71.4,26.28 71.4,27.17 v70.77,27.8 70.64,27.93 69.5,27.93
IGA2  (via drill 0.3)
  Top 0.305: U2.4 67.35,47.35 68.1,46.6 68.1,31.61 66.58,30.09 v66.58,27.3 66.58,27.04 66.83,26.79 66.83,26.28 66.58,26.03 66.58,19.8 v66.45,19.68 | U6.4 70.12,27.28 v70.13,27.3 | U1.4 67.45,7.09 68.1,7.74 68.1,18.02 v67.72,18.41 67.72,19.42 67.97,19.68 68.99,19.68 v69.37,19.29 | R3.2 86.89,18.55 SW1.7 v85.5,18.91
  Bottom 0.305: v70.13,27.3 v66.58,27.3 | v67.72,18.41 v66.45,19.68 | v85.5,18.91 84.23,17.64 71.02,17.64 v69.37,19.29
IGA3  (via drill 0.3)
  Top 0.305: U2.5 67.11,46.7 67.59,46.22 67.59,31.87 66.07,30.34 66.07,28.18 65.56,27.68 65.56,27.04 66.07,26.53 v66.2,26.53 | v70.64,26.53 70.67,26.63 U6.5 | U1.5 67.57,6.44 68.61,7.48 v68.61,18.91 | R3.3 87.94,17.64 SW1.6 v85.5,17.64
  Bottom 0.305: 67.59,26.53 68.61,25.52 v68.61,18.91 70.39,17.14 84.99,17.14 v85.5,17.64 | v70.64,26.53 arc90 70.64,26.66 67.72,26.66 arc90 67.59,26.53 | 67.59,26.53 v66.2,26.53
IGA4  (via drill 0.3)
  Top 0.254: U1.24 75.44,6.44
  Top 0.305: 75.44,6.44 v75.47,6.47 | v85.37,16.37 SW1.5 87.47,16.37 R3.4 88.05,16.11 v88.17,15.99 | U6.24 v76.48,26.63 v76.48,26.64 | U2.24 74.17,46.7 v74.2,46.73 | v81.18,16.37 v81.18,11.67
  Bottom 0.305: v75.47,6.47 75.47,6.21 75.97,5.71 80.8,5.71 81.18,6.09 v81.18,11.67 | v74.2,46.73 75.09,46.73 76.48,45.33 v76.48,26.64 87.05,26.64 87.91,25.77 87.91,16.25 v88.17,15.99 | v85.37,16.37 v81.18,16.37
IMUE  (via drill 0.3)
  Top 0.254: U4.3 46.71,45.27 46.51,45.08 46.51,44.44 46.64,44.31 U4.28 46.64,42.53 | 46.64,42.53 v47.27,41.9 | 46.64,42.53 C9.1 | v75.59,40 v77.12,39.97 | v88.29,13.83 SW1.3
  Bottom 0.254: v47.27,41.9 47.65,41.52 53.5,41.52 55.02,40 v75.59,40 | v77.12,39.97 77.12,31.61 81.05,27.68 86.77,27.68 88.42,26.03 88.42,17.01 88.93,16.5 88.93,14.47 v88.29,13.83
MOT1  (via drill 0.3)
  Top 0.254: U7.6 21.36,10.02 v21.62,10.28 | v67.72,25.52 68.31,25.98 U6.6
  Bottom 0.254: v21.62,10.28 21.62,16.88 23.4,18.66 63.07,18.61 66.04,21.58 66.96,21.58 67.21,21.83 67.21,23.87 66.96,24.12 66.96,25.01 67.47,25.52 v67.72,25.52
MOT2  (via drill 0.3)
  Top 0.254: U7.5 21.86,9.25 v22.25,9.64 | v67.72,24.76 67.85,24.76 68.43,25.34 U6.7
  Bottom 0.254: v22.25,9.64 22.25,16.75 23.65,18.15 63.27,18.1 66.25,21.07 67.21,21.07 67.72,21.58 v67.72,24.76 67.59,24.88
MOT3  (via drill 0.3)
  Top 0.254: U8.6 79.41,37.84 76.48,34.92 76.48,30.85 75.59,29.96 73.43,29.96 72.29,28.69 72.29,24.96 v71.96,24.63 | U6.8 70.59,24.68 v70.64,24.63
  Bottom 0.254: v70.64,24.63 v71.96,24.63
MOT4
  Top 0.254: U8.5 78.91,38.1 75.97,35.17 75.97,31.11 75.34,30.47 73.31,30.47 71.78,28.82 71.78,27.04 71.28,26.53 71.28,24.25 71.06,24.03 U6.9
MOT5  (via drill 0.3)
  Top 0.254: U9.6 20.73,39.87 v20.48,39.61 | U6.10 72.39,23.38 v72.42,23.36
  Bottom 0.254: v20.48,39.61 20.48,34.66 24.16,30.98 70.77,30.98 72.42,29.33 72.42,25.39 72.67,25.14 72.67,24.37 72.42,24.12 v72.42,23.36
MOT6  (via drill 0.3)
  Top 0.254: U9.5 20.23,40.77 v19.71,40.25 | v71.53,22.72 69,22.72 U6.11
  Bottom 0.254: v19.71,40.25 19.71,34.66 23.9,30.47 70.64,30.47 71.91,29.2 71.91,25.64 71.53,25.26 70.26,25.26 70.01,25.01 70.01,24.25 v71.53,22.72
MOT7  (via drill 0.3)
  Top 0.305: U10.6 79.91,9.13 80.17,9.39 81.18,9.39 81.82,10.02 81.82,20.18 80.04,21.96 v79.02,21.96 | U6.12 v70.64,22.08 v70.64,22.09
  Bottom 0.305: v70.64,22.09 78.9,22.09 v79.02,21.96
MOT8  (via drill 0.3)
  Top 0.305: U10.5 81.75,8.56 82.45,9.26 82.45,20.44 80.29,22.6 78.26,22.6 77.63,21.96 v77.63,21.33 | U6.13 69.99,21.43 v70.01,21.45
  Bottom 0.305: v70.01,21.45 77.5,21.45 v77.63,21.33
N$1
  Top 0.305: R7.8 63.93,37.96 JP3.16
N$2
  Top 0.305: R7.7 60.7,39.01 JP3.15
N$3
  Top 0.305: U2.23 R1.2
N$4  (via drill 0.3)
  Top 0.305: U1.23 74.75,5.79 v75.85,4.69 | v74.07,7.23 R2.2
  Bottom 0.305: v75.85,4.69 74.07,6.47 v74.07,7.23
N$5
  Top 0.305: R7.6 59.9,38.91 JP3.14
N$6
  Top 0.305: R7.5 56.93,38.22 JP3.13
N$7
  Top 0.305: R5.7 50.54,39.01 JP3.11
N$8  (via drill 0.36)
  Top 0.305: v51.84,39.74 51.34,40.24 R5.8
  Bottom 0.305: JP3.12 53.62,37.96 v51.84,39.74
N$9
  Top 0.305: R5.6 49.74,38.91 JP3.10
N$10
  Top 0.305: R5.5 46.77,38.22 JP3.9
N$11
  Top 0.305: R4.8 43.55,37.96 JP3.8
N$12
  Top 0.305: R4.7 40.33,39.06 JP3.7
N$13
  Top 0.305: R4.6 39.53,38.86 JP3.6
N$14
  Top 0.305: R4.5 36.56,38.22 JP3.5
N$15
  Top 0.305: R6.8 33.37,37.96 JP3.4
N$16
  Top 0.305: R6.7 30.15,39.09 JP3.3
N$17
  Top 0.305: R6.6 29.35,38.83 JP3.2
N$18
  Top 0.305: R6.5 26.38,38.22 JP3.1
N$19
  Top 0.305: R22.1 LED1.A
N$20
  Top 0.254: U5.8 38.6,48.08 R21.1
N$22
  Top 0.305: R23.1 LED2.A
N$23
  Top 0.305: U6.23 76.1,25.98 R30.2
N$24
  Top 0.254: U4.9 45.64,48.31 C10.1
N$25
  Top 0.305: R24.1 LED3.A
N$26
  Top 0.305: U7.2 20.86,3.93 JP7.1
N$28
  Top 0.305: U7.3 21.36,3.93 JP7.2
N$29
  Top 0.305: U8.2 79.91,46.09 JP8.1
N$30
  Top 0.305: U8.3 79.41,46.09 JP8.2
N$31
  Top 0.305: U9.2 21.23,45.96 JP9.1
N$32
  Top 0.305: U9.3 20.73,46.21 JP9.2
N$33
  Top 0.305: U10.2 79.41,3.93 JP10.1
N$34  (via drill 0.3)
  Top 0.305: R32.2 8.7,7.48 v9.93,7.48 | v5.36,6.47 5.43,6.53 Q2.1
  Bottom 0.305: v9.93,7.48 6.63,7.48 5.62,6.47 v5.36,6.47
N$35
  Top 0.305: R8.1 63.57,11.55 JP4.16
N$36
  Top 0.305: R8.2 60.63,10.93 JP4.15
N$37
  Top 0.305: R8.3 59.83,10.68 JP4.14
N$38
  Top 0.305: R8.4 56.63,11.8 JP4.13
N$39
  Top 0.305: R9.1 53.28,11.55 JP4.12
N$40
  Top 0.305: R9.2 50.34,10.8 JP4.11
N$41
  Top 0.305: R9.3 49.54,10.8 JP4.10
N$42
  Top 0.305: R9.4 46.34,11.8 JP4.9
N$43
  Top 0.305: R10.1 43.25,11.55 JP4.8
N$44
  Top 0.305: R10.2 40.31,10.93 JP4.7
N$45
  Top 0.305: R10.3 39.51,10.68 JP4.6
N$46
  Top 0.305: R10.4 36.31,11.8 JP4.5
N$47
  Top 0.305: R11.1 33.04,11.55 JP4.4
N$48
  Top 0.305: R11.2 30.1,10.88 JP4.3
N$49
  Top 0.305: R11.3 29.3,10.73 JP4.2
N$50
  Top 0.305: R11.4 26.1,11.8 JP4.1
N$52  (via drill 0.3)
  Top 0.305: v7.65,10.02 7.1,9.47 Q2.3 4.22,9.47 R33.1 | v10.06,22.22 8.68,22.22 Q1.1
  Bottom 0.305: v7.65,10.02 9.68,10.02 10.7,11.04 10.7,21.58 v10.06,22.22
N$66
  Top 0.305: U10.3 79.91,3.93 JP10.2
PWR
  Top 0.305: R29.2 78.01,35.3 78.64,35.93 S1.1
S01
  Top 0.305: R7.4 59.1,45.02 60.15,46.07 66.31,46.07 U2.6
S02
  Top 0.305: R7.3 59.9,44.75 60.56,45.41 U2.7
S03
  Top 0.305: R7.2 60.7,44.26 61.19,44.75 U2.8
S04
  Top 0.305: R7.1 61.5,43.68 61.9,44.08 66.31,44.08 U2.9
S05  (via drill 0.3)
  Top 0.305: R5.1 v51.34,42.33 | v62.64,40.63 62.64,42.71 63.38,43.45 U2.10
  Bottom 0.305: v51.34,42.33 52.94,43.93 60.35,43.93 62.64,41.65 v62.64,40.63
S06  (via drill 0.3)
  Top 0.305: R5.2 50.54,42.96 v50.63,43.04 | v63.4,41.27 63.4,42.43 63.78,42.81 66.31,42.81 U2.11
  Bottom 0.305: v50.63,43.04 52.02,44.44 60.73,44.44 63.15,42.03 63.15,41.39 v63.4,41.27
S07  (via drill 0.3)
  Top 0.305: R5.3 49.74,43.48 v49.94,43.68 | v64.04,41.9 64.29,42.15 U2.12
  Bottom 0.305: v49.94,43.68 51.21,44.95 61.12,44.95 63.78,42.28 63.78,42.15 v64.04,41.9
S08  (via drill 0.3)
  Top 0.305: R5.4 48.94,43.95 v49.3,44.31 | v65.05,41.27 65.29,41.5 U2.13
  Bottom 0.305: v49.3,44.31 50.45,45.46 62.26,45.46 65.05,42.66 v65.05,41.27
S09  (via drill 0.3)
  Top 0.305: R4.1 v41.13,42.33 | 72.96,40.85 U2.15 72.17,40.86 v74.3,40.86
  Bottom 0.305: v41.13,42.33 44.76,45.96 66.45,45.96 67.21,45.2 67.21,44.06 67.26,44.06 70.46,40.86 v74.3,40.86
S10  (via drill 0.3)
  Top 0.305: R4.2 40.33,42.94 v40.44,43.04 | v73.43,41.52 73.42,41.5 U2.16
  Bottom 0.305: v73.43,41.52 70.59,41.52 70.56,41.49 67.72,44.34 67.72,45.46 66.7,46.47 44.48,46.47 41.18,43.17 40.57,43.17 v40.44,43.04
S11  (via drill 0.3)
  Top 0.305: R4.3 39.53,43.41 v39.8,43.68 | v74.2,42.15 v74.19,42.15 U2.17
  Bottom 0.305: v74.2,42.15 70.64,42.15 68.23,44.57 68.23,45.96 67.21,46.98 44.22,46.98 41.05,43.81 39.93,43.81 v39.8,43.68
S12  (via drill 0.3)
  Top 0.305: R4.4 38.73,43.9 v39.14,44.31 | v73.43,42.79 72.17,42.79 U2.18
  Bottom 0.305: v73.43,42.79 70.77,42.79 68.74,44.82 68.74,46.6 67.85,47.49 43.84,47.49 40.8,44.44 39.27,44.44 v39.14,44.31
S13  (via drill 0.3)
  Top 0.305: R6.1 30.97,41.66 v30.97,42.33 | v74.2,43.42 72.19,43.42 U2.19
  Bottom 0.305: v30.97,42.33 36.63,48 68.1,48 69.24,46.85 69.24,45.2 71.02,43.42 v74.2,43.42
S14  (via drill 0.3)
  Top 0.305: R6.2 30.15,42.94 v30.25,43.04 | v73.41,44.11 72.17,44.11 U2.20
  Bottom 0.305: v30.25,43.04 35.72,48.5 68.35,48.5 69.75,47.11 69.75,45.53 71.17,44.11 v73.41,44.11
S15  (via drill 0.3)
  Top 0.305: R6.3 29.35,43.41 v29.62,43.68 | v74.25,44.75 U2.21
  Bottom 0.305: v29.62,43.68 34.95,49.01 68.61,49.01 70.26,47.36 70.26,45.76 71.28,44.75 v74.25,44.75
S16  (via drill 0.3)
  Top 0.305: R6.4 28.55,43.88 v28.98,44.31 | v73.41,45.41 U2.22
  Bottom 0.305: v28.98,44.31 34.19,49.52 68.99,49.52 70.77,47.74 70.77,46.12 71.48,45.41 v73.41,45.41
S17
  Top 0.305: R8.8 61.37,8.1 61.37,7.36 62.93,5.79 U1.6
S18
  Top 0.305: R8.7 60.73,8.05 60.73,7.23 62.82,5.14 U1.7
S19
  Top 0.305: R8.6 59.97,8.01 59.97,7.23 62.71,4.49 U1.8
S20
  Top 0.305: R8.5 59.08,8.1 59.08,7.23 62.47,3.84 U1.9
S21
  Top 0.305: R9.8 51.21,8.08 51.21,7.23 55.25,3.19 U1.10
S22
  Top 0.305: R9.7 50.45,8.05 50.45,7.23 55.14,2.54 U1.11
S23
  Top 0.305: R9.6 49.56,8.13 49.56,7.36 55.02,1.89 U1.12
S24
  Top 0.305: R9.5 48.8,8.1 48.8,7.36 54.91,1.24 U1.13
S25  (via drill 0.3)
  Top 0.305: R10.8 v41.1,7.41 | v70.89,7.36 70.51,7.36 69.12,5.96 69.12,2.02 70.55,0.59 U1.15
  Bottom 0.305: v41.1,7.41 44.45,4.05 66.2,4.05 69.5,7.36 v70.89,7.36
S26  (via drill 0.3)
  Top 0.305: R10.7 40.31,6.93 v40.47,6.77 | U1.16 70.66,1.24 69.62,2.28 69.62,5.71 70.39,6.47 v70.89,6.47
  Bottom 0.305: v40.47,6.77 43.69,3.55 66.45,3.55 69.37,6.47 v70.89,6.47
S27  (via drill 0.3)
  Top 0.305: R10.6 39.51,6.46 v39.83,6.14 | U1.17 71.28,1.89 71.28,1.9 70.77,1.9 70.13,2.53 70.13,5.32 70.39,5.58 v70.89,5.58
  Bottom 0.305: v39.83,6.14 42.93,3.04 66.7,3.04 69.24,5.58 v70.89,5.58
S28  (via drill 0.3)
  Top 0.305: R10.5 38.71,5.89 v39.14,5.45 | U1.18 71.02,2.53 70.7,2.85 70.7,4.5 v70.89,4.69
  Bottom 0.305: v39.14,5.45 42.07,2.53 69.62,2.53 70.89,3.8 v70.89,4.69
S29  (via drill 0.3)
  Top 0.305: R11.8 v30.9,7.41 v30.89,7.41 | U1.19 73.41,3.19 v73.94,2.66
  Bottom 0.305: v30.89,7.41 36.27,2.02 73.31,2.02 v73.94,2.66
S30  (via drill 0.3)
  Top 0.305: R11.7 30.1,6.88 v30.25,6.72 | U1.20 73.77,3.84 74.58,3.04 v74.58,2.15
  Bottom 0.305: v30.25,6.72 35.46,1.51 73.94,1.51 v74.58,2.15
S31  (via drill 0.3)
  Top 0.305: R11.6 29.3,6.41 v29.62,6.09 | U1.21 74.01,4.49 75.21,3.29 v75.21,1.64
  Bottom 0.305: v29.62,6.09 34.7,1.01 74.58,1.01 v75.21,1.64
S32  (via drill 0.3)
  Top 0.305: R11.5 28.5,5.94 v28.98,5.45 | U1.22 74.38,5.14 75.85,3.67 v75.85,1.13
  Bottom 0.305: v28.98,5.45 33.94,0.5 75.21,0.5 v75.85,1.13
SCL  (via drill 0.3, 0.36)
  Top 0.254: v55.15,43.04 54.89,43.3 54.89,47.62 52.96,49.55 40.39,49.55 40.16,49.27 40.16,48.68 U5.6 | v52.61,42.28 52.61,31.74 53.5,30.85 | 53.5,30.85 65.05,30.85 66.83,32.63 v66.83,37.2 | 53.5,30.85 53.11,30.47 22.63,30.47 v22.13,29.96
  Top 0.305: U2.26 70.39,48 69.62,47.23 69.62,40 70.26,39.36 70.26,38.47 v70.13,38.47 69.62,37.96 69.62,34.92 v69.88,34.66 | R12.2 v74.07,15.1 | v71.66,13.83 v71.66,11.45 | v73.05,7.74 U1.26 71.53,7.74 71.15,8.12 69.75,8.12 69.12,8.75 69.12,17.39 73.18,21.45 73.18,27.68 v73.05,27.93 | v75.85,27.93 v75.84,27.93 U6.26
  Bottom 0.254: v55.15,43.04 53.37,43.04 v52.61,42.28 | v66.83,37.2 68.1,38.47 v70.13,38.47 | v22.13,29.96 17.05,29.96 14,33.01 JP11.4
  Bottom 0.305: v74.07,15.1 72.93,15.1 v71.66,13.83 | v73.05,7.74 73.43,8.12 73.43,10.79 72.77,11.45 v71.66,11.45 | v73.05,27.93 v75.85,27.93 75.85,30.72 71.91,34.66 v69.88,34.66
SCL33
  Top 0.254: U5.2 39.68,46.24 39.91,46.47 41.56,46.47 41.81,46.22 41.81,44.95 41.99,44.77 U4.19
SDA  (via drill 0.3, 0.36)
  Top 0.254: 55.15,32.12 55.15,42.03 54.38,42.79 54.38,47.36 52.5,49.14 41,49.14 U5.5 | 55.15,32.12 55.91,31.36 64.8,31.36 66.2,32.76 v66.2,38.6 | v69.62,39.11 69.5,38.98 69.12,38.98 | 55.15,32.12 v55.15,31.61 | v50.19,31.87 49.3,30.98 v22.13,30.98 | v15.9,33.01 13.74,33.01 v13.24,33.52
  Top 0.305: U2.27 70.15,48.65 69.12,47.62 69.12,38.98 69.12,34.28 v69.88,33.52 | U1.27 71.64,8.39 71.4,8.63 70.01,8.63 69.62,9.01 69.62,16.37 | 69.62,16.37 69.62,17.14 73.69,21.2 v73.69,28.57 | R13.2 69.62,16.37 | v73.69,28.57 73.71,28.58 73.82,28.58 | 73.82,28.58 U6.27 | v73.69,28.57 73.8,28.57 73.82,28.58
  Bottom 0.254: v66.2,38.6 66.7,39.11 v69.62,39.11 | v55.15,31.61 55.02,31.49 50.57,31.49 v50.19,31.87 | v22.13,30.98 17.94,30.98 v15.9,33.01 | v13.24,33.52 13.24,42.79 JP11.3
  Bottom 0.305: v73.69,28.57 73.18,29.07 73.18,29.45 69.88,32.76 v69.88,33.52
SDA33
  Top 0.229: U5.3 40.16,44.82
  Top 0.254: U4.20 42.58,43.81 40.67,43.81 40.18,44.3 40.16,44.82
TERM  (via drill 0.3)
  Top 0.305: R13.1 R12.1 77.33,15.74 v77.88,15.74 | v88.17,14.98 88.04,15.1 SW1.4
  Bottom 0.305: v77.88,15.74 87.4,15.74 v88.17,14.98
VCC  (via drill 0.3)
  Top 0.254: R21.2 38.42,46.38 38.76,46.73 38.76,47.23 39.68,48.15 U5.7 | v9.3,38.34 9.3,43.93 JP11.2
  Top 0.305: SW1.13 SW1.12 SW1.11 SW1.10 SW1.9 v80.04,20.18 | SW1.13 80.17,15.1 80.67,14.6 80.67,13.07 80.17,12.56 SW1.15 | v25.94,45.71 26.61,46.38 C15.1 R21.2 | 72.63,9.77 C7.1 72.63,12.65 73.88,13.9 | 72.63,9.77 72.63,9.51 U1.28 | 73.88,13.9 73.94,13.96 77.5,13.96 78.64,15.1 SW1.13 | C2.1 72.76,15.02 73.88,13.9 | R14.1 64.76,9.6 v64.8,9.64 | v72.16,9.64 72.51,9.64 72.63,9.77 | v85.37,25.77 85.37,27.42 84.74,28.06 R22.2 83.09,28.1 83.09,30.6 81.56,32.12 | 77.12,44.57 77.12,46.85 76.48,47.49 74.96,47.49 74.49,47.96 C1.1 arc90 74.2,49.3 U2.28 | 77.12,44.57 77.12,41.77 76.36,41.01 75.59,41.01 73.18,38.6 C6.1 | S1.3 81.56,32.12 | 81.56,32.12 83.09,33.65 83.09,36.44 84.23,37.58 84.23,43.55 v83.21,44.57 | v77.88,44.57 77.12,44.57 | v4.09,6.47 R33.2 | v17.43,38.34 v9.3,38.34 | v16.03,8.25 v17.81,8.25
  Top 0.406: R33.2 3.29,7.65 2.7,8.25 2.7,19.9 Q1.2
  Top 1.016: C25.1 v3.71,38.34 2.7,38.34 1.81,37.46 1.81,27.68 2.95,26.53 U11.1 4.12,21.32 Q1.2
  Bottom 0.305: 3.58,38.47 v3.71,38.34 v9.3,38.34 | v80.04,20.18 83.59,20.18 85.37,21.96 v85.37,25.77 | v83.21,44.57 v77.88,44.57 | v72.16,9.64 v64.8,9.64 27.08,9.64 26.19,8.75 19.71,8.75 19.21,8.25 v17.81,8.25 | v25.94,45.71 19.84,45.71 18.06,43.93 18.06,38.98 v17.43,38.34 | v4.09,6.47 5.87,8.25 v16.03,8.25
VCCIO  (via drill 0.3, 0.36)
  Top 0.254: v7.65,15.61 7.65,15.27 Q1.3
  Top 0.305: U9.1 23.04,43.36 C22.2 23.18,43.3 v24.16,43.3 | U7.1 19.05,6.66 C21.2 18.84,6.65 v18.09,6.65 | U8.1 81.59,43.36 C18.2 81.98,43.3 v82.83,43.3 | U10.1 77.73,6.66 C24.2 77.59,6.72 v76.48,6.72 | v75.59,38.6 v78.01,38.6 | R23.2 83.98,26.79 84.48,26.28 84.48,25.01 84.99,24.5 86.9,24.5 87.53,25.14 87.53,41.52 v85.75,43.3
  Top 1.422: 7.32,13.95 7.7,14.33 C5.+ 14.74,3.57 J1.P$1 | 18.7,14.33 19.68,14.33 20.48,14.37 20.48,35.66
  Top 1.524: JP2.16 63.78,14.34 JP2.15 61.24,14.09 JP2.14 58.7,14.34 JP2.13 56.16,14.09 JP2.12 53.62,14.34 JP2.11 51.08,14.09 JP2.10 48.54,14.34 JP2.9 46,14.09 JP2.8 43.46,14.34 JP2.7 40.92,14.09 JP2.6 38.38,14.34 JP2.5 35.84,14.09 JP2.4 33.3,14.34 JP2.3 30.76,14.09 JP2.2 28.22,14.34 JP2.1 25.92,14.33 18.7,14.33 v18.19,14.33 C5.+ | JP6.1 25.92,35.66 v24.16,35.66 20.48,35.66 C3.+ 14.81,34.99 | 7.32,13.95 Q1.3
  Bottom 0.254: 7.65,14.38 7.7,14.33
  Bottom 0.305: v24.16,43.3 v24.16,35.66 | 25.92,35.66 JP6.1 | v18.09,6.65 16.92,7.81 16.92,9.41 18.06,10.56 18.06,14.33 v18.19,14.33 18.09,14.23 | JP2.16 66.07,12.06 75.85,12.06 76.48,11.42 v76.48,6.72 | JP6.16 72.42,35.42 v75.59,38.6 | v78.01,38.6 80.29,38.6 82.83,41.14 v82.83,43.3 v85.75,43.3
  Bottom 1.524: JP6.1 JP6.2 JP6.3 JP6.4 JP6.5 JP6.6 JP6.7 JP6.8 JP6.9 JP6.10 JP6.11 JP6.12 JP6.13 JP6.14 JP6.15 JP6.16
  other vias: 4.22,16.5 5.11,16.5 5.11,15.61 4.22,15.61 8.54,15.61 7.65,16.5 8.54,16.5
  pour Bottom (no thermals): 3.33,18.41 9.81,18.41 9.81,11.04 3.33,11.04

### Text on the board
tPlace: 1 | 2 | 3 | 4 | 5 | 6 | 7 | 8 | 9 | 10 | 11 | 12 | 13 | 14 | 15 | 16 | 17 | 18 | 19 | 20 | 21 | 22 | 23 | 24 | 25 | 26 | 27 | 28 | 29 | 30 | 31 | 32
bPlace: 2015 Mundo Reader S.L.
tNames: VCC | ON